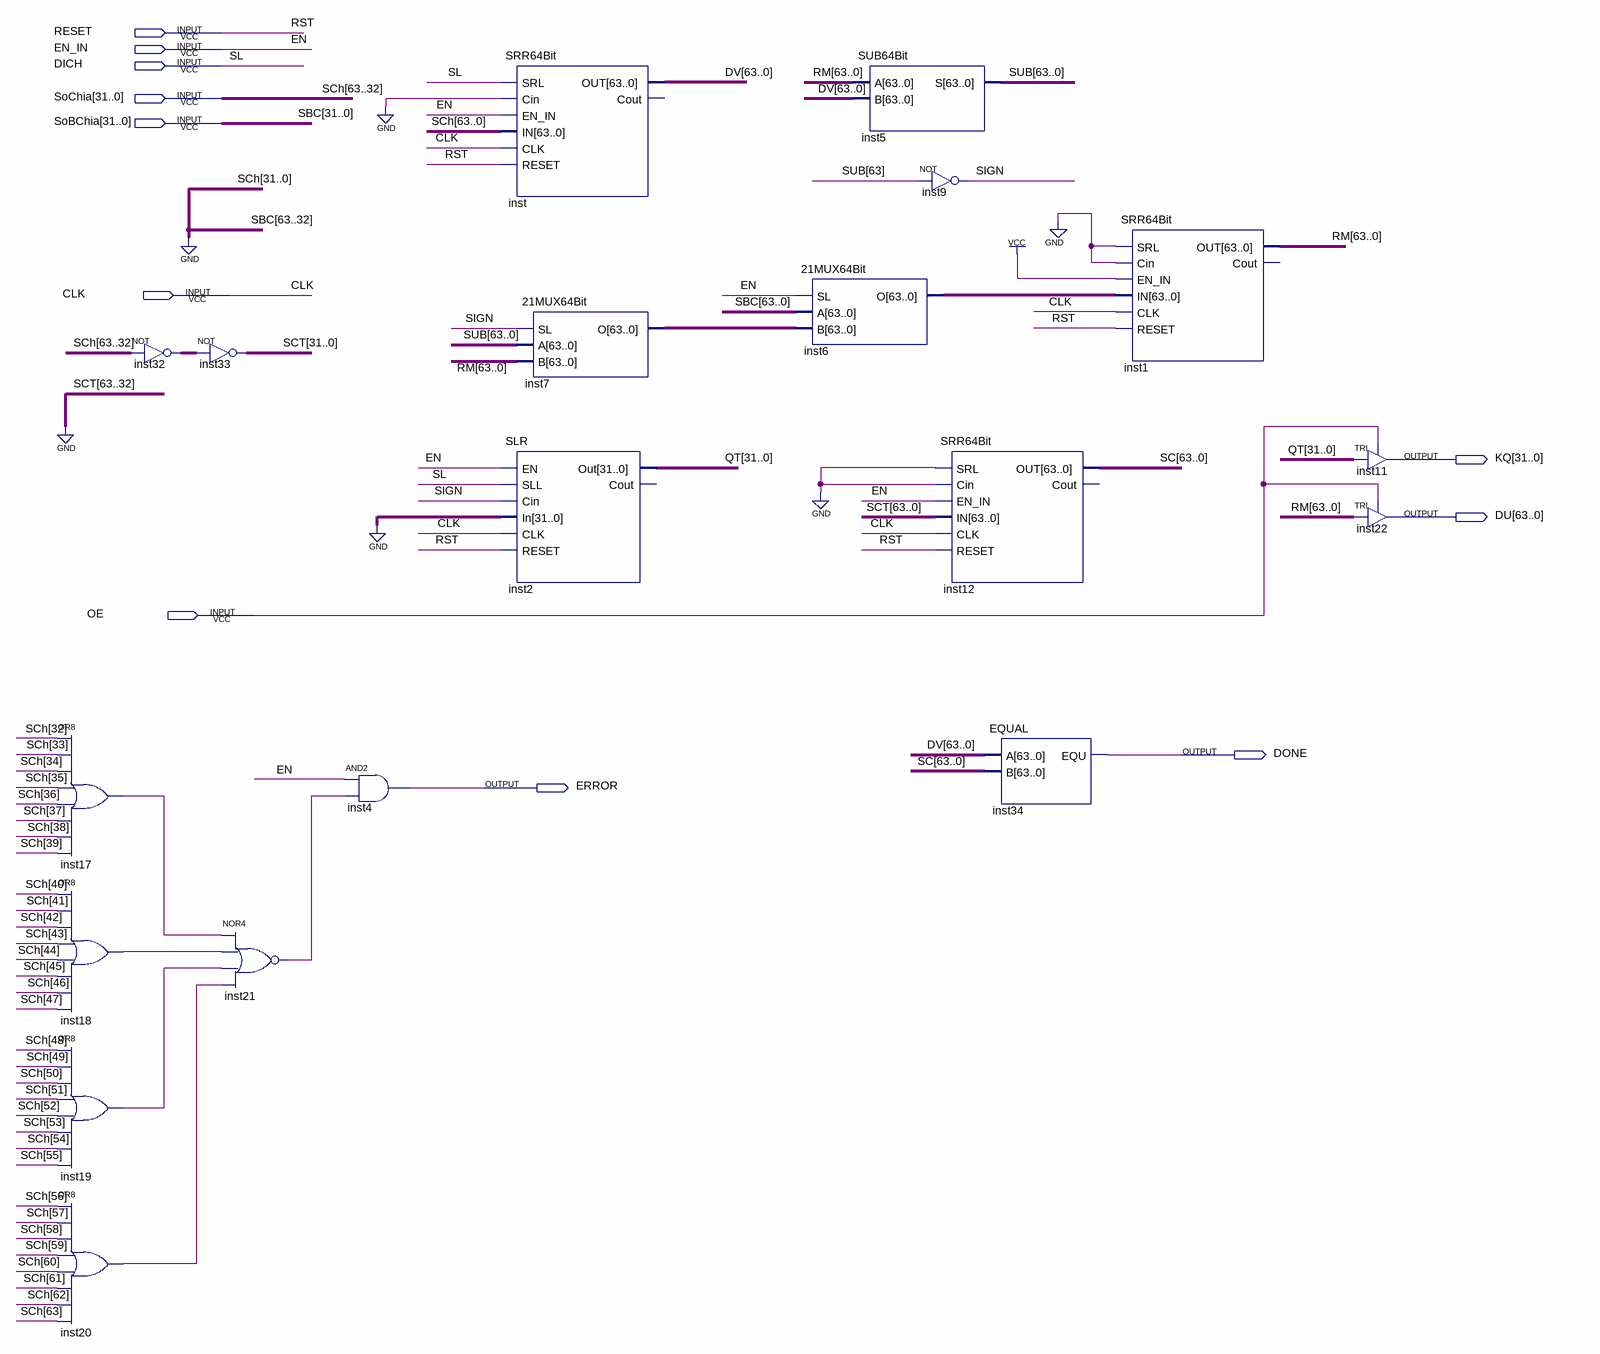
[diagram p0: schematic sheet]
// Quartus schematic DIV2.bdf as structural Verilog: 19 symbols, 11 pins
module DIV2 (
  input  RESET,
  input  EN_IN,
  input  DICH,
  input  [31:0] SoChia,
  input  [31:0] SoBChia,
  input  CLK,
  input  OE,
  output [31:0] KQ,
  output [63:0] DU,
  output DONE,
  output ERROR
);

  wire inst17_out, inst18_out, inst19_out, inst20_out, inst21_out, SIGN;
  wire [31:0] inst32_out, QT, SCh, SCT;
  wire [63:0] DV, inst6_o, inst7_o, RM, SC, SUB;

  or inst17 (inst17_out, SoChia[0], SoChia[1], SoChia[2], SoChia[3], SoChia[4], SoChia[5], SoChia[6], SoChia[7]);
  or inst18 (inst18_out, SoChia[8], SoChia[9], SoChia[10], SoChia[11], SoChia[12], SoChia[13], SoChia[14], SoChia[15]);
  or inst19 (inst19_out, SoChia[16], SoChia[17], SoChia[18], SoChia[19], SoChia[20], SoChia[21], SoChia[22], SoChia[23]);
  or inst20 (inst20_out, SoChia[24], SoChia[25], SoChia[26], SoChia[27], SoChia[28], SoChia[29], SoChia[30], SoChia[31]);
  assign inst32_out = ~SoChia;  // NOT inst32, 32 bits wide
  assign SCT = ~inst32_out;  // NOT inst33, 32 bits wide
  nor inst21 (inst21_out, inst17_out, inst18_out, inst19_out, inst20_out);
  and inst4 (ERROR, EN_IN, inst21_out);
  SRR64Bit inst (
    .SRL(DICH), .Cin(1'b0), .EN_IN(EN_IN), .IN({SoChia, SCh}), .CLK(CLK), .RESET(RESET), .OUT(DV));  // open: Cout
  SLR inst2 (.EN(EN_IN), .SLL(DICH), .Cin(SIGN), .In({32{1'b0}}), .CLK(CLK), .RESET(RESET), .Out(QT));  // open: Cout
  \21MUX64Bit  inst7 (.SL(SIGN), .A(SUB), .B(RM), .O(inst7_o));
  \21MUX64Bit  inst6 (.SL(EN_IN), .A({{32{1'b0}}, SoBChia}), .B(inst7_o), .O(inst6_o));
  SUB64Bit inst5 (.A(RM), .B(DV), .S(SUB));
  not inst9 (SIGN, SUB[63]);
  SRR64Bit inst12 (
    .SRL(1'b0), .Cin(1'b0), .EN_IN(EN_IN), .IN({{32{1'b0}}, SCT}), .CLK(CLK), .RESET(RESET), .OUT(SC));  // open: Cout
  EQUAL inst34 (.A(DV), .B(SC), .EQU(DONE));
  SRR64Bit inst1 (
    .SRL(1'b0), .Cin(1'b0), .EN_IN(1'b1), .IN(inst6_o), .CLK(CLK), .RESET(RESET), .OUT(RM));  // open: Cout
  TRI inst11[31:0] (.IN(QT), .OE(OE), .OUT(KQ));
  TRI inst22[63:0] (.IN(RM), .OE(OE), .OUT(DU));

  // Other names for the same wires on the sheet: EN = EN_IN; RST = RESET; SBC[31:0] = SoBChia; SCh[63:32] = SoChia;
  //   SL = DICH
endmodule
